# EAGLE schematic EIT sample circuit (EAGLE 7.7.0)
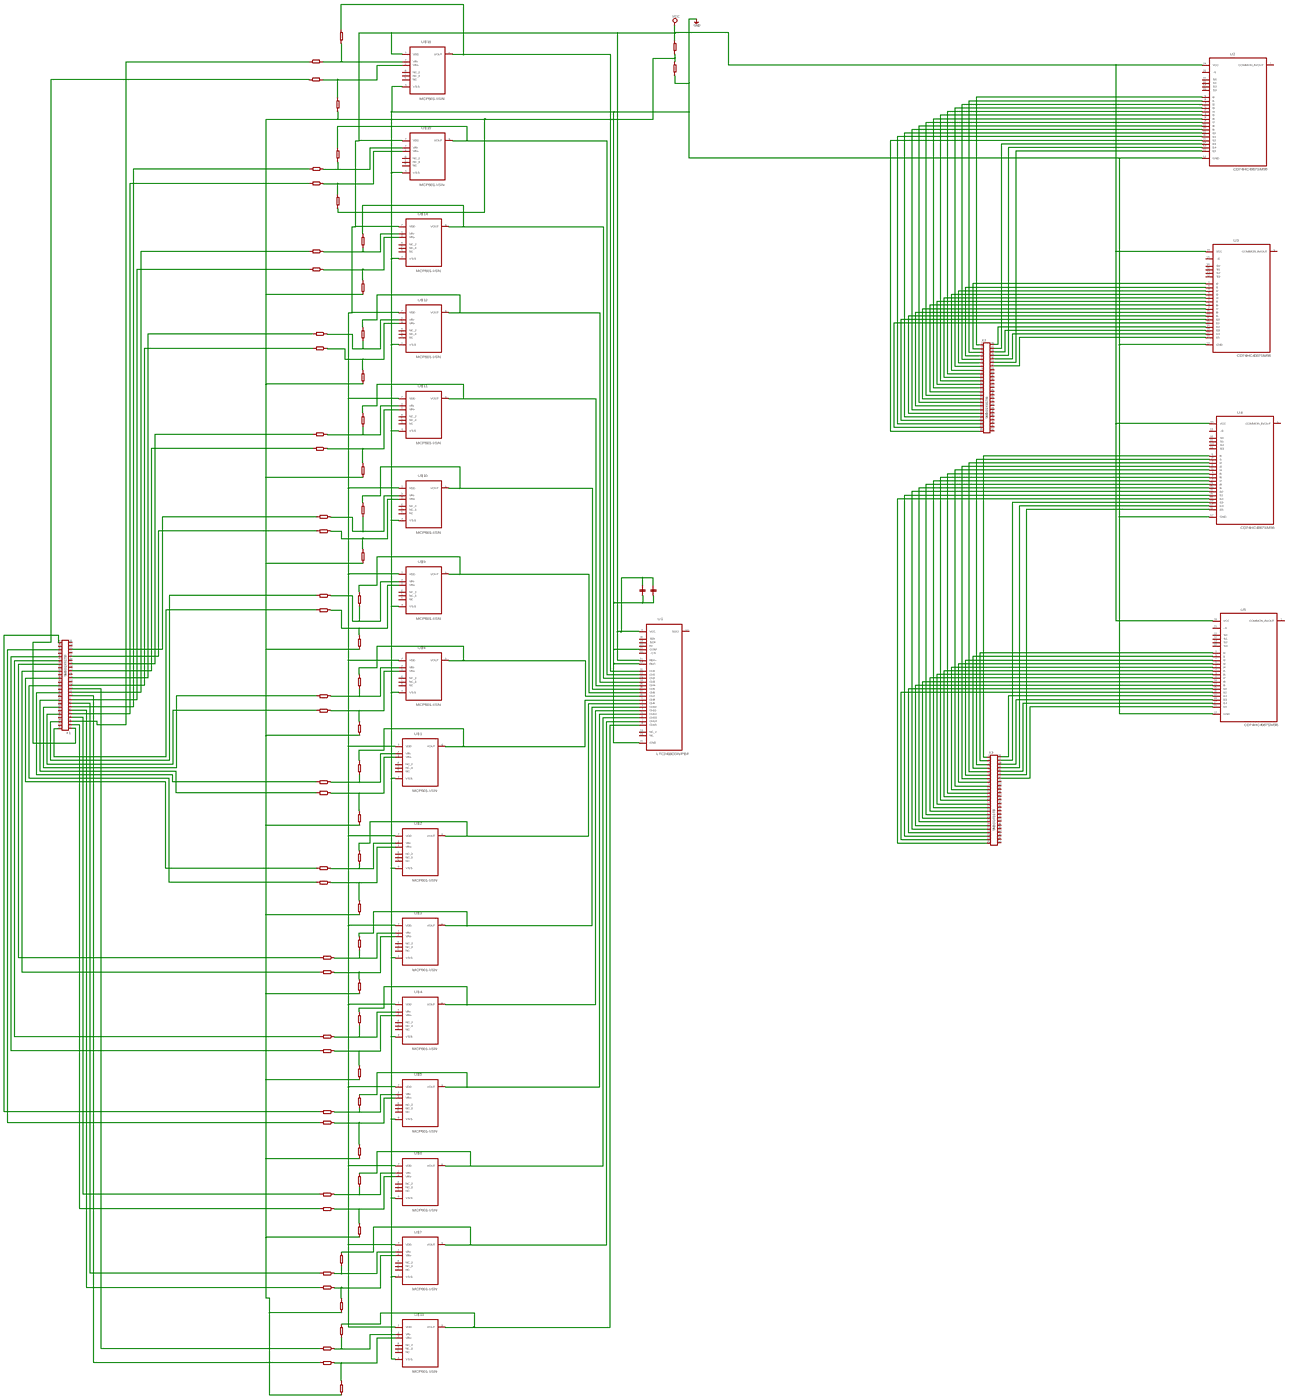
[diagram p0: schematic, sheet 1, overview]
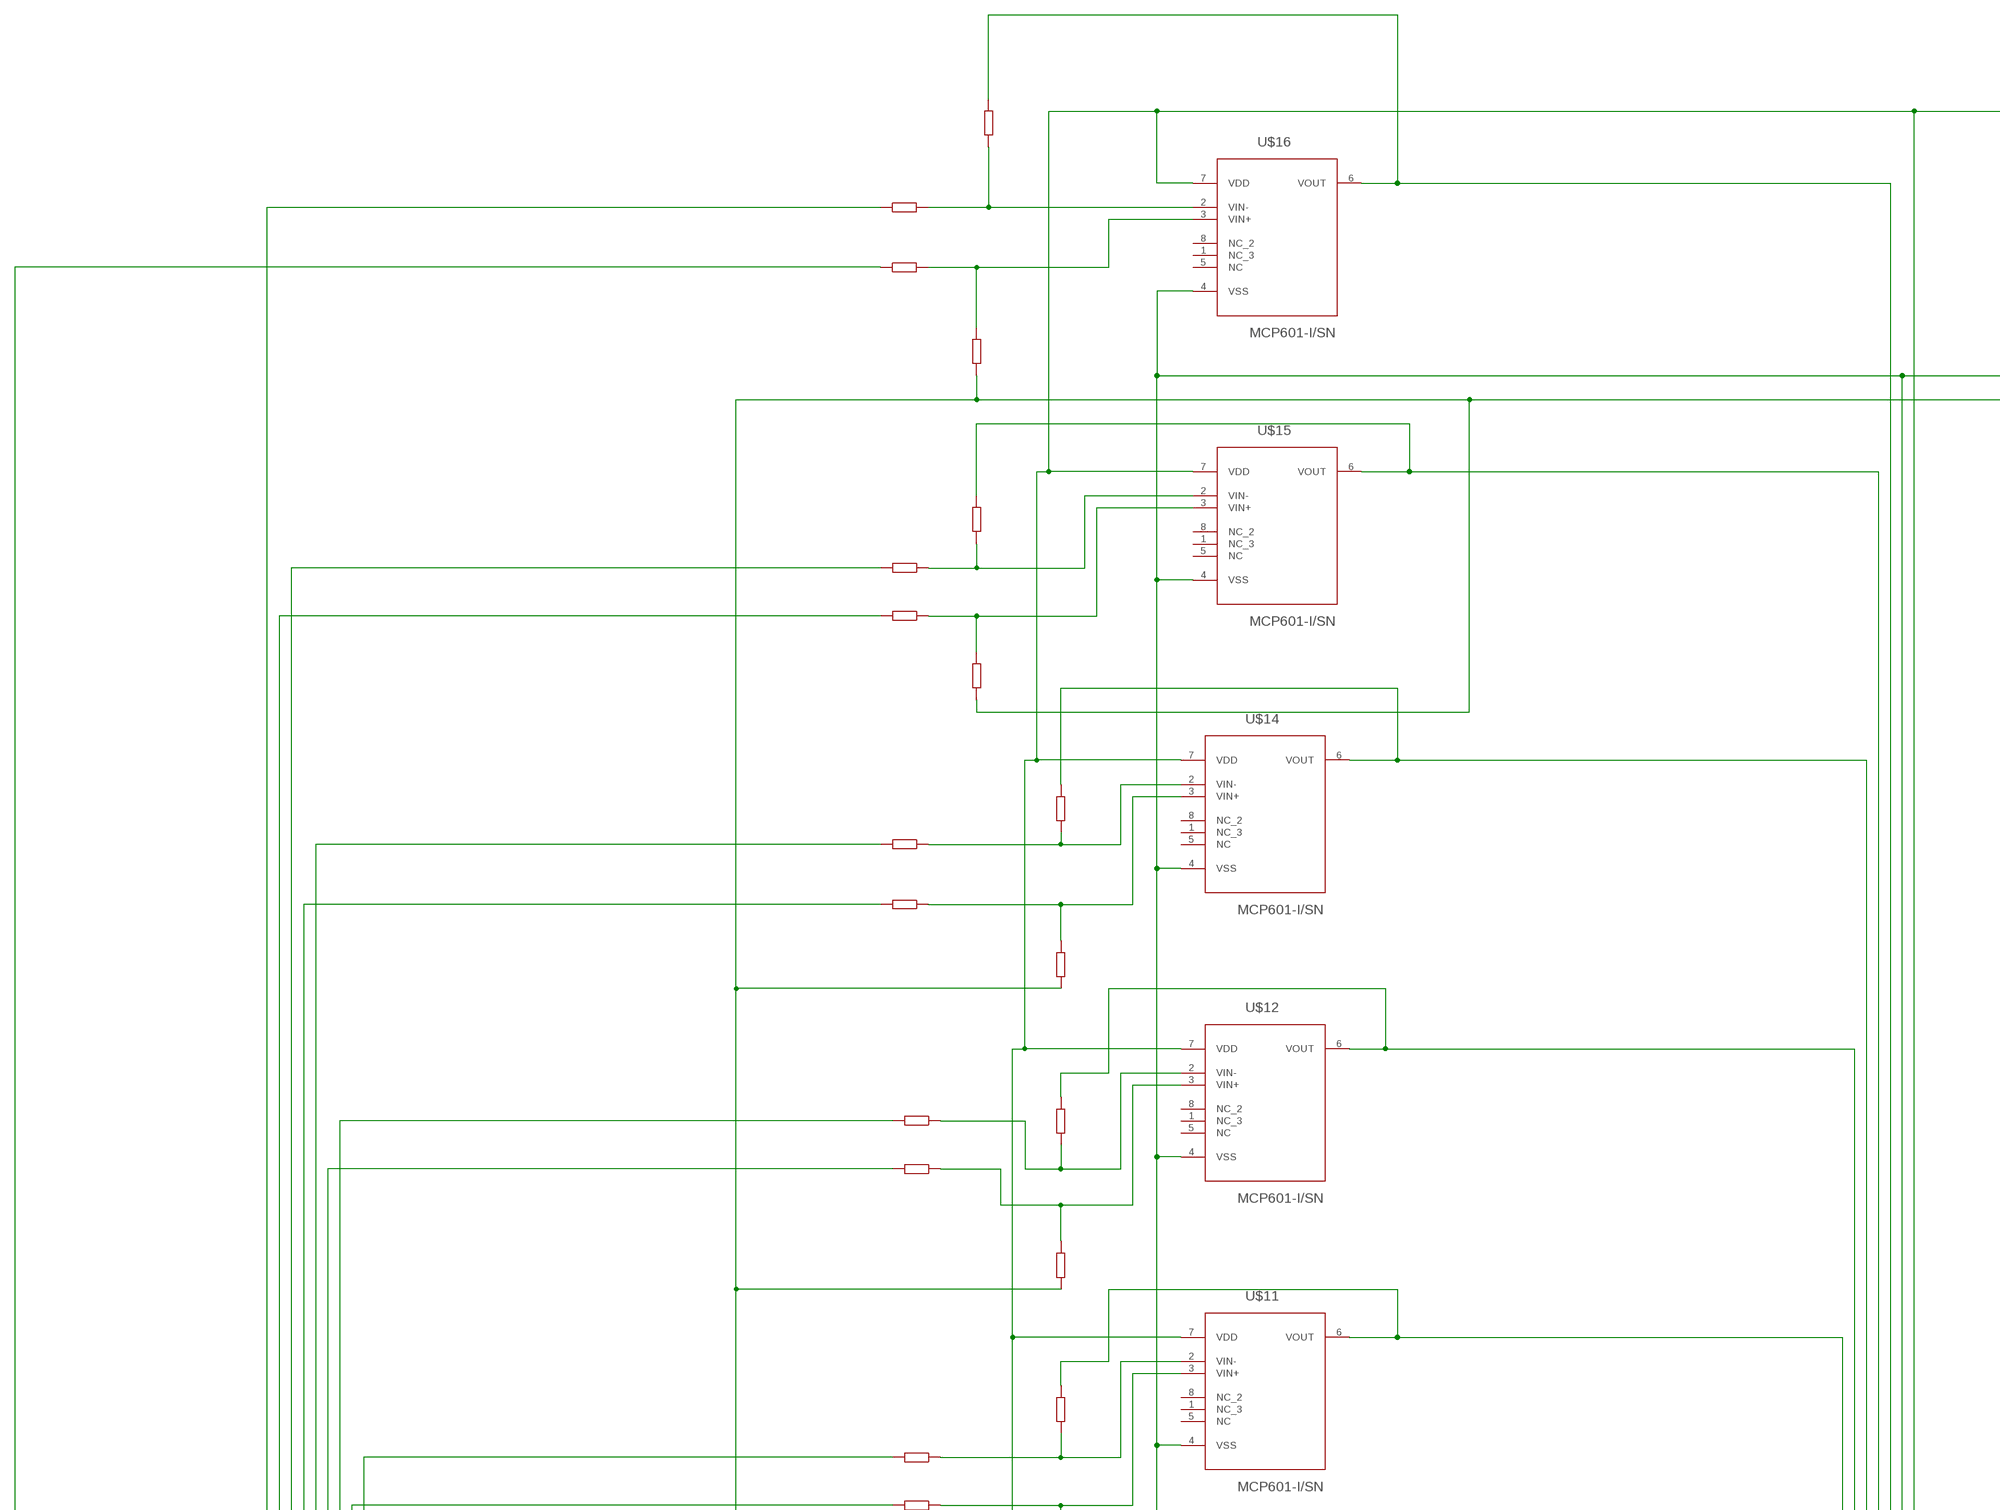
[diagram p1: schematic, sheet 1, part 1 of 5]
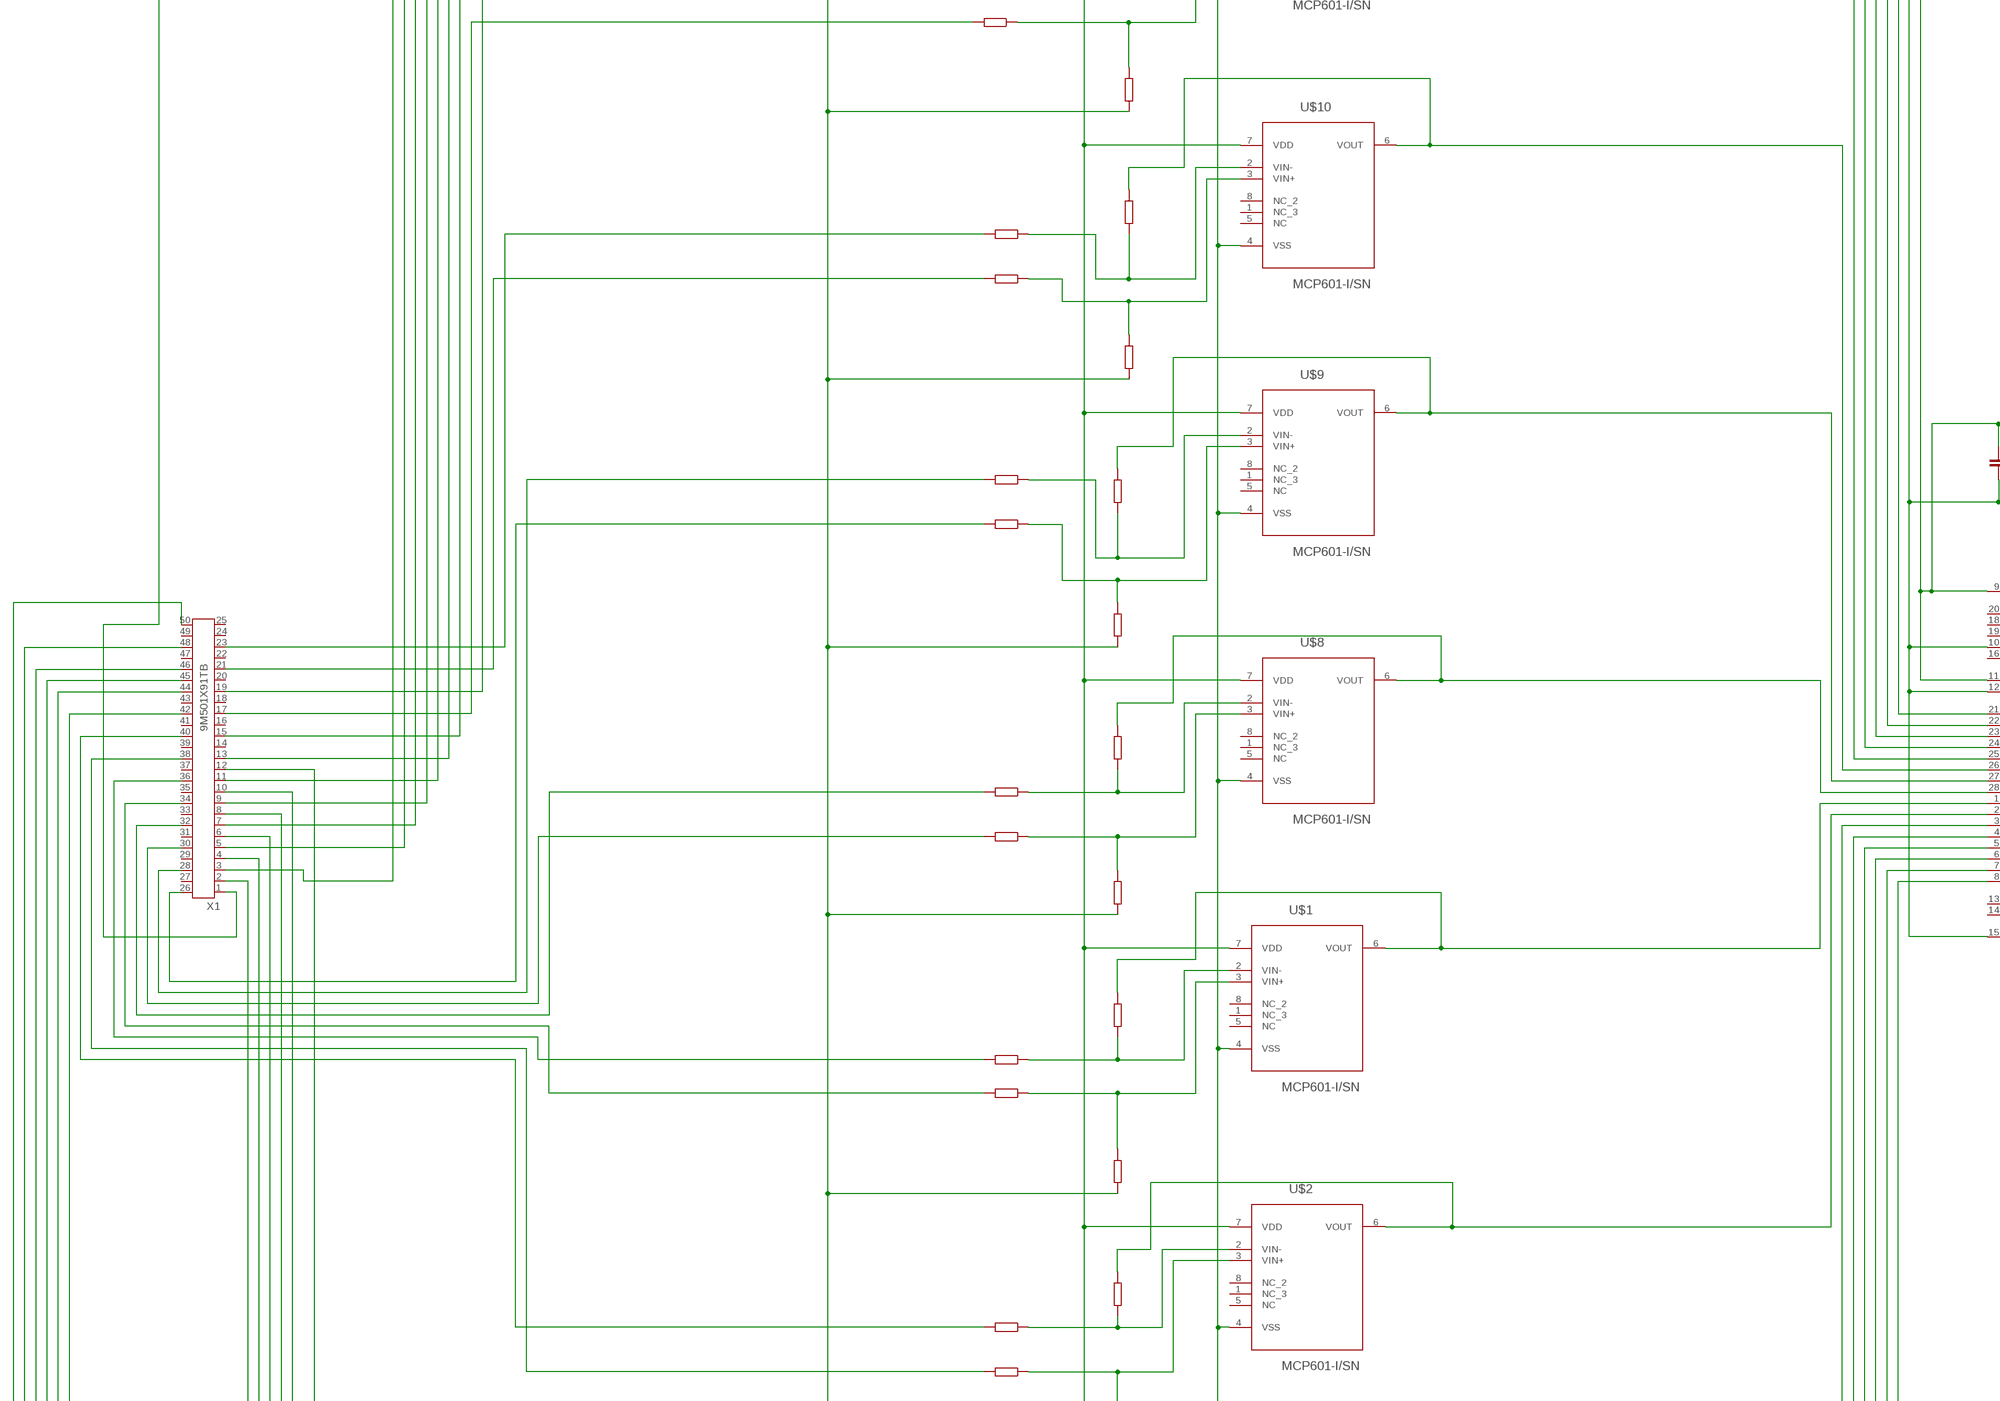
[diagram p2: schematic, sheet 1, part 2 of 5]
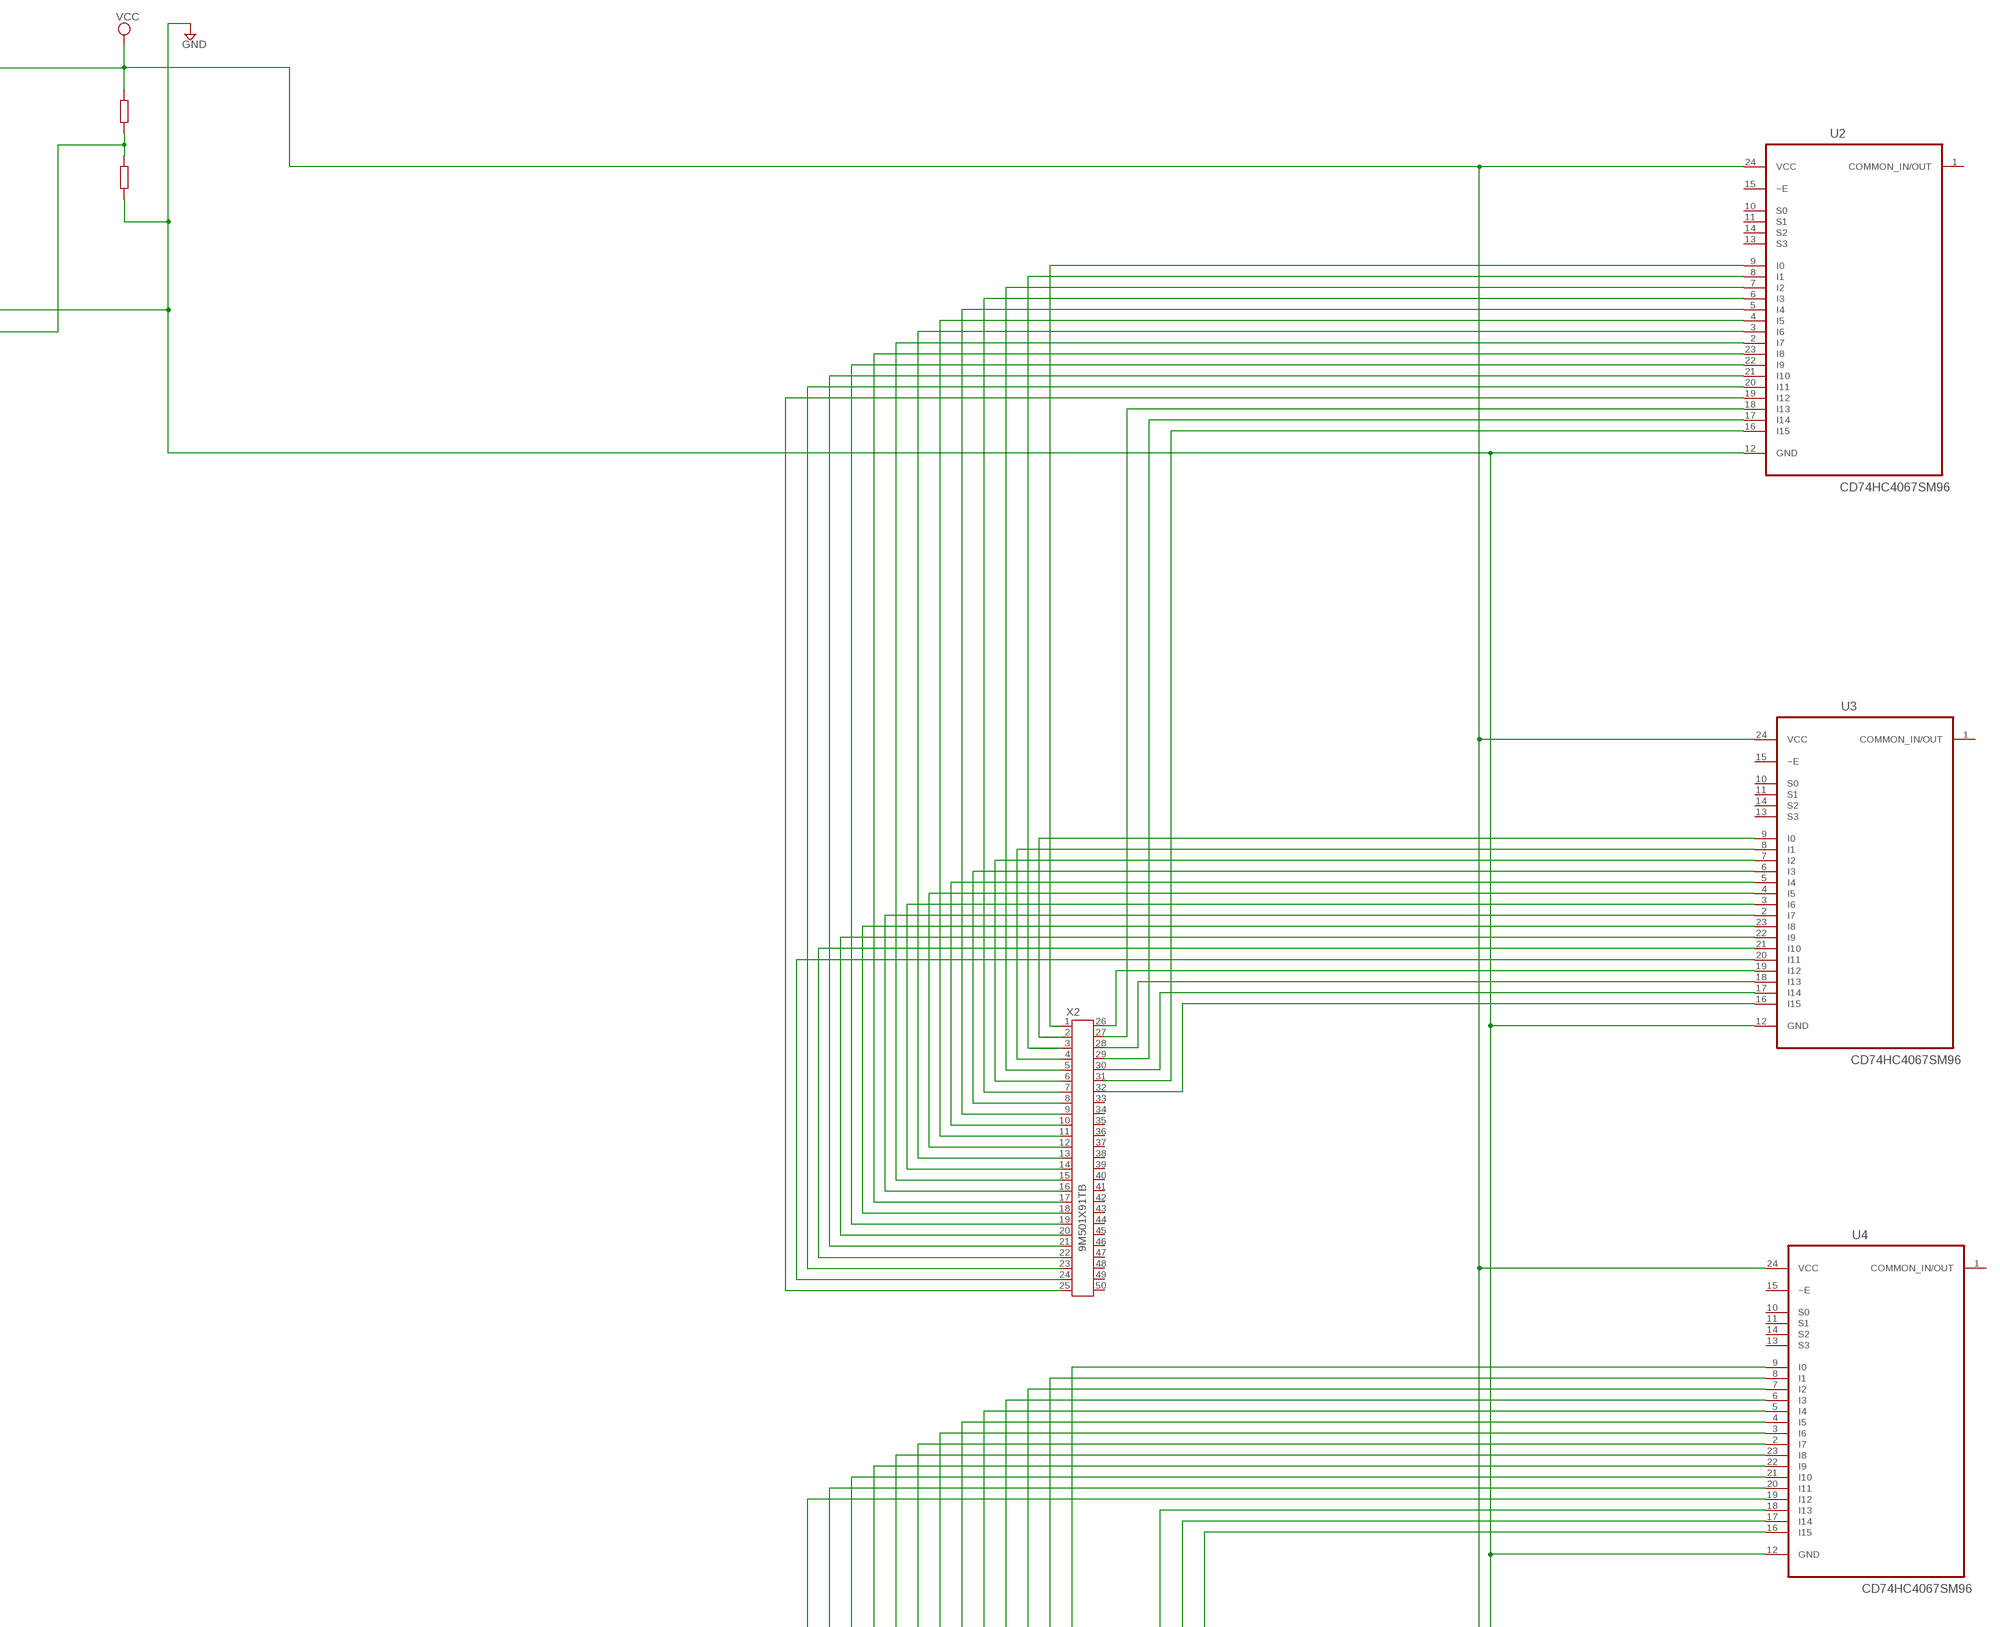
[diagram p3: schematic, sheet 1, part 3 of 5]
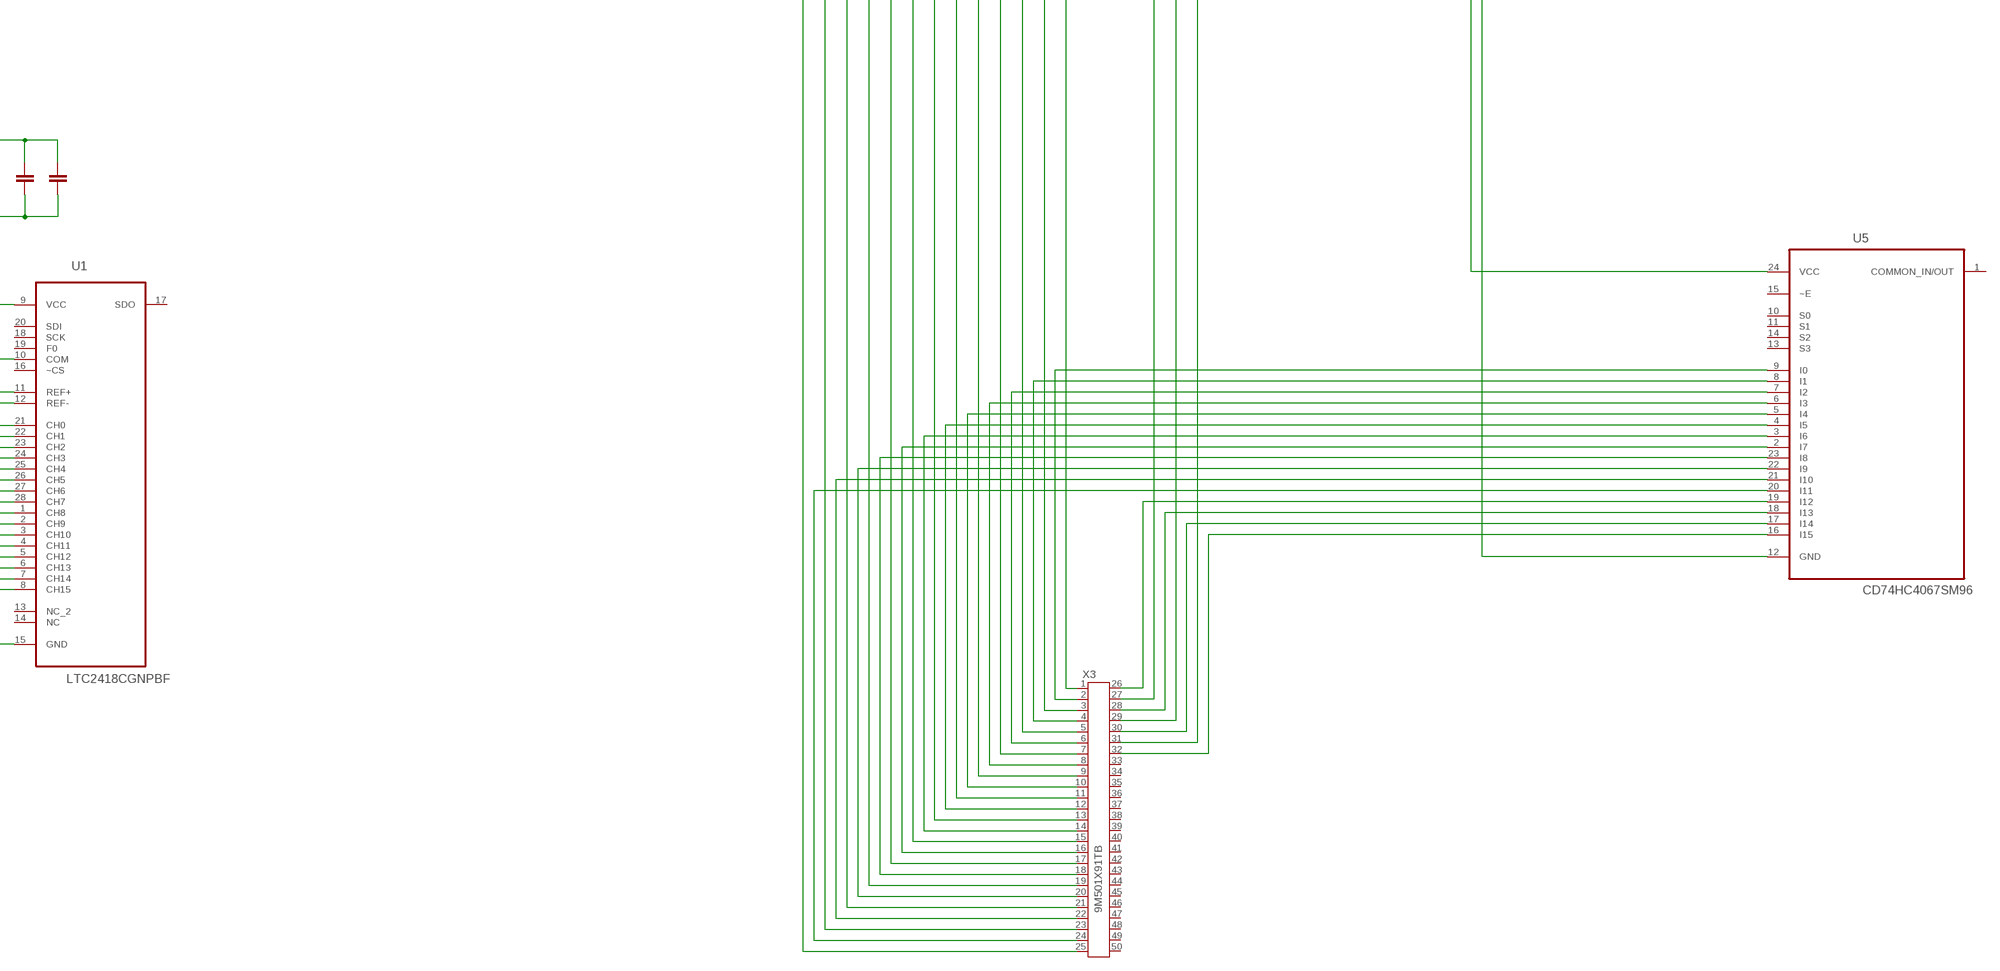
[diagram p4: schematic, sheet 1, part 4 of 5]
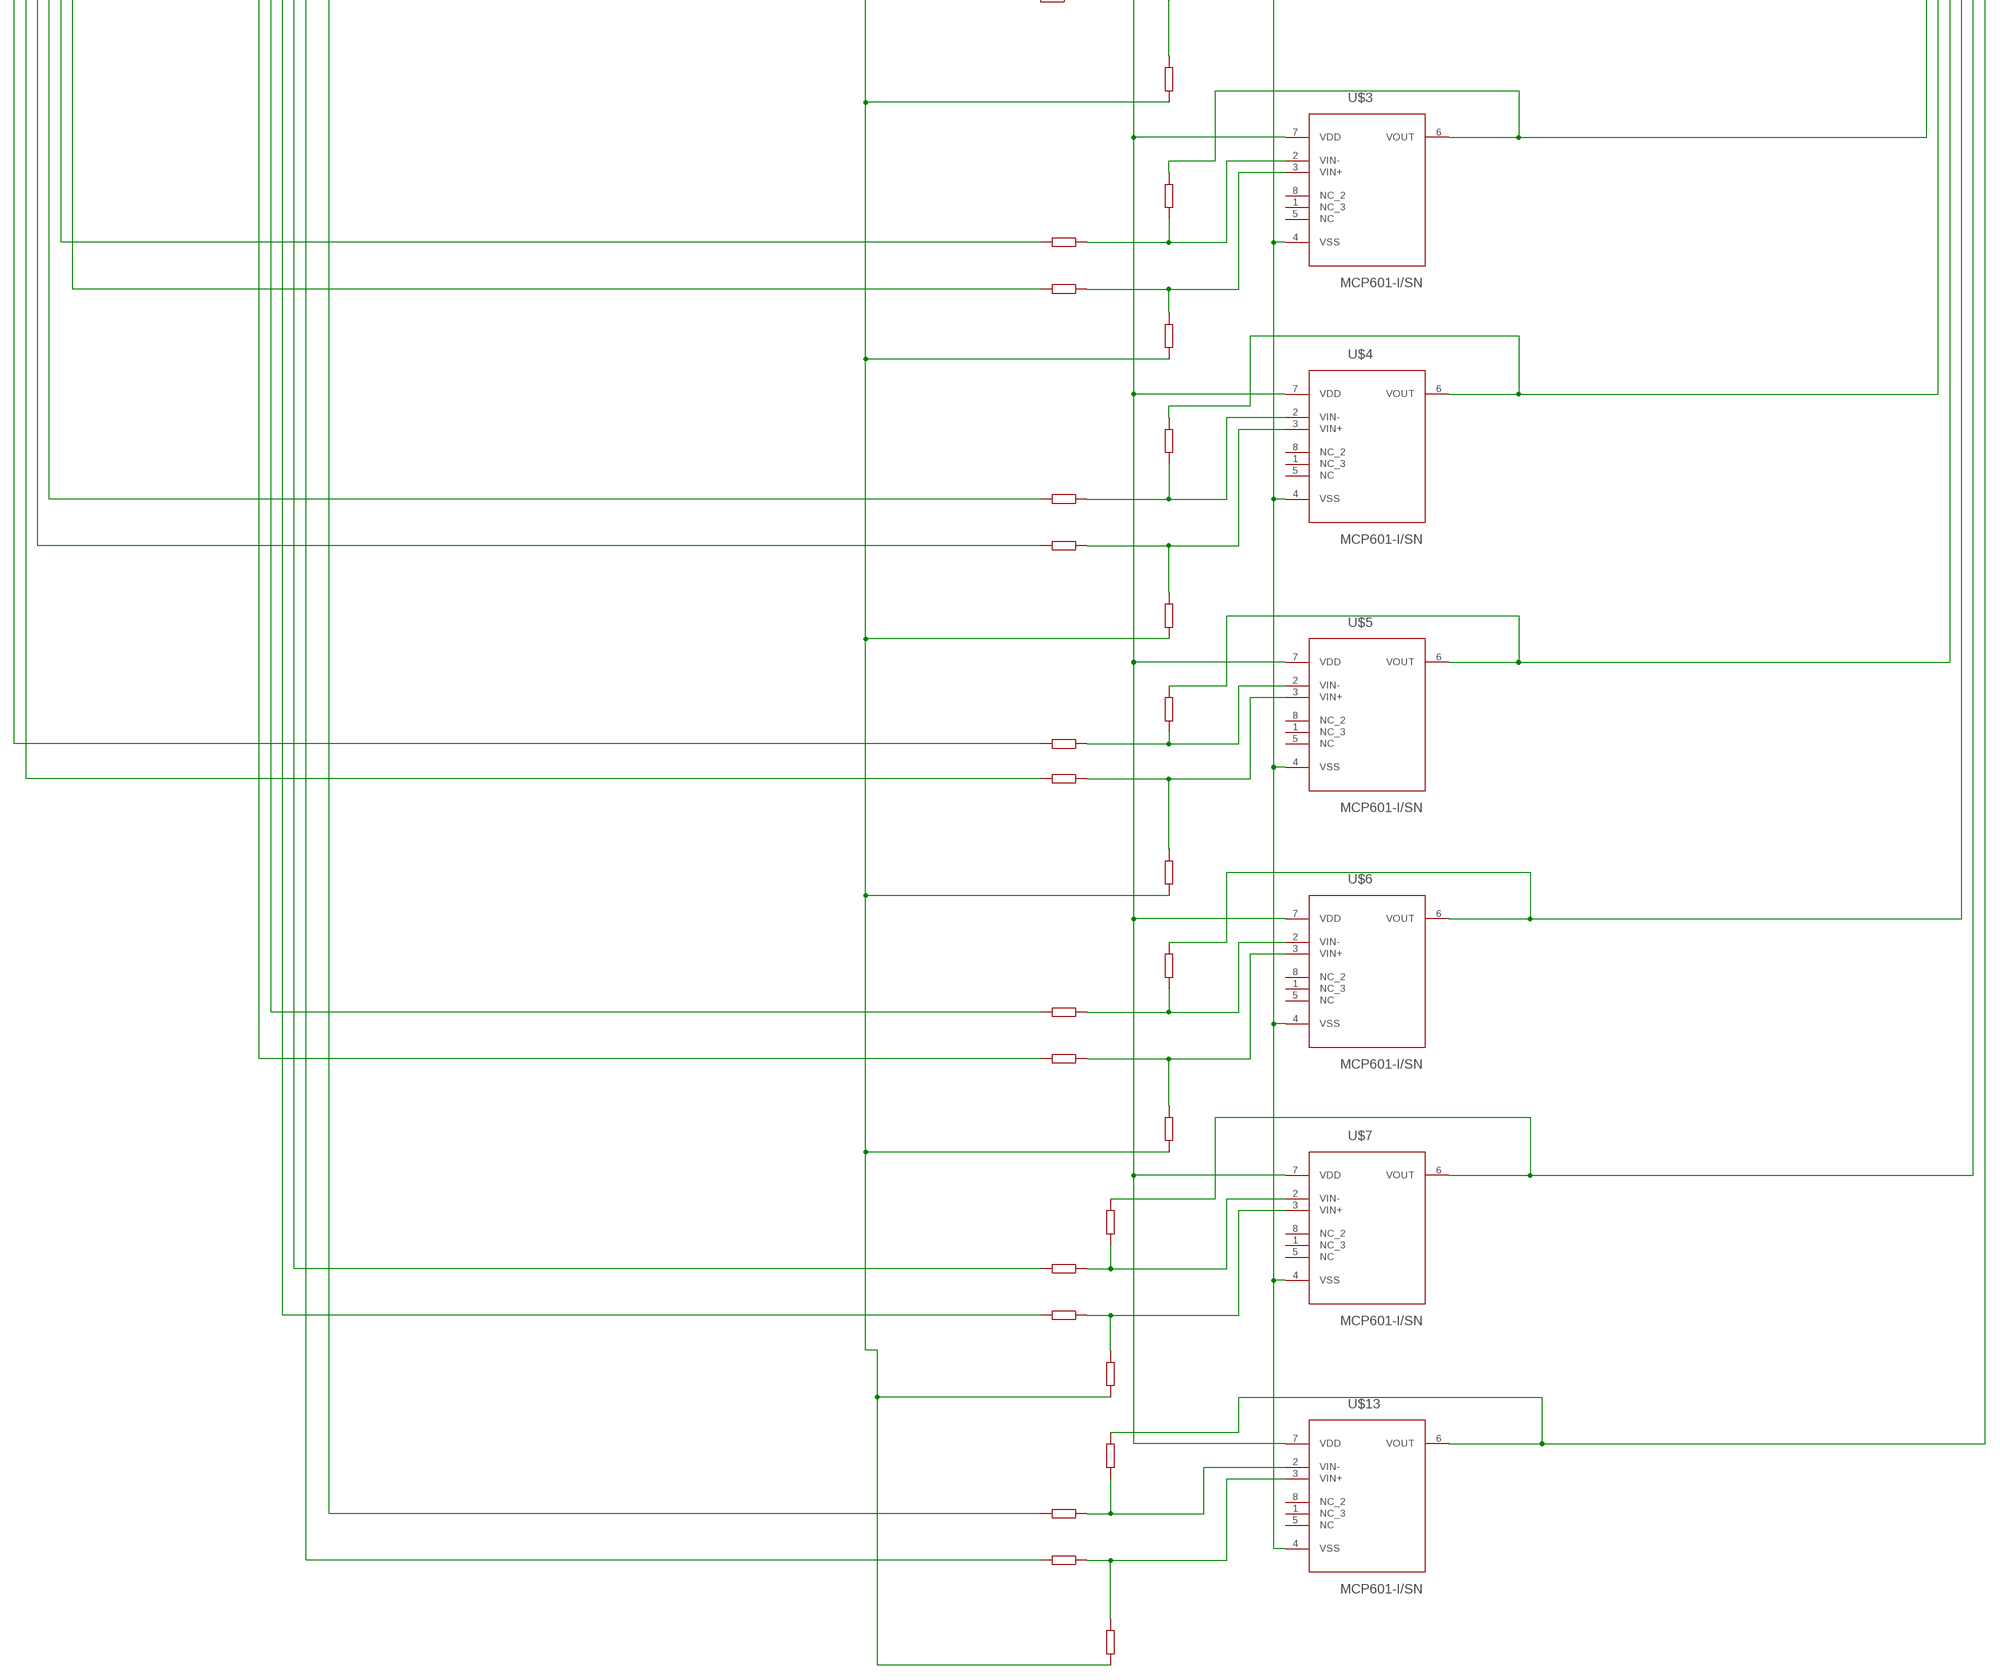
[diagram p5: schematic, sheet 1, part 5 of 5]

## Parts
U1  LTC2418CGNPBF  [SOP63P600X175-28N]
U2  CD74HC4067SM96  [SOP65P780X200-24N]
U3  CD74HC4067SM96  [SOP65P780X200-24N]
U4  CD74HC4067SM96  [SOP65P780X200-24N]
U5  CD74HC4067SM96  [SOP65P780X200-24N]
U$1  MCP601-I/SN  [SOIC127P600X175-8N]
U$2  MCP601-I/SN  [SOIC127P600X175-8N]
U$3  MCP601-I/SN  [SOIC127P600X175-8N]
U$4  MCP601-I/SN  [SOIC127P600X175-8N]
U$5  MCP601-I/SN  [SOIC127P600X175-8N]
U$6  MCP601-I/SN  [SOIC127P600X175-8N]
U$7  MCP601-I/SN  [SOIC127P600X175-8N]
U$8  MCP601-I/SN  [SOIC127P600X175-8N]
U$9  MCP601-I/SN  [SOIC127P600X175-8N]
U$10  MCP601-I/SN  [SOIC127P600X175-8N]
U$11  MCP601-I/SN  [SOIC127P600X175-8N]
U$12  MCP601-I/SN  [SOIC127P600X175-8N]
U$13  MCP601-I/SN  [SOIC127P600X175-8N]
U$14  MCP601-I/SN  [SOIC127P600X175-8N]
U$15  MCP601-I/SN  [SOIC127P600X175-8N]
U$16  MCP601-I/SN  [SOIC127P600X175-8N]
X1  9M501X91TB  [9M501X91]
X2  9M501X91TB  [9M501X91]
X3  9M501X91TB  [9M501X91]

## Nets
GND: U1.10(COM) U1.12(REF-) U1.15(GND) U2.12(GND) U3.12(GND) U4.12(GND) U5.12(GND) U$1.4(VSS) U$2.4(VSS) U$3.4(VSS) U$4.4(VSS) U$5.4(VSS) U$6.4(VSS) U$7.4(VSS) U$8.4(VSS) U$9.4(VSS) U$10.4(VSS) U$11.4(VSS) U$12.4(VSS) U$13.4(VSS) U$14.4(VSS) U$15.4(VSS) U$16.4(VSS)
N$1: U1.21(CH0) U$16.6(VOUT)
N$2: U1.22(CH1) U$15.6(VOUT)
N$3: U1.23(CH2) U$14.6(VOUT)
N$4: U1.24(CH3) U$12.6(VOUT)
N$5: U1.25(CH4) U$11.6(VOUT)
N$6: U1.26(CH5) U$10.6(VOUT)
N$7: U1.27(CH6) U$9.6(VOUT)
N$8: U1.28(CH7) U$8.6(VOUT)
N$9: U1.1(CH8) U$1.6(VOUT)
N$10: U1.2(CH9) U$2.6(VOUT)
N$11: U1.3(CH10) U$3.6(VOUT)
N$12: U1.4(CH11) U$4.6(VOUT)
N$13: U1.5(CH12) U$5.6(VOUT)
N$14: U1.6(CH13) U$6.6(VOUT)
N$15: U1.7(CH14) U$7.6(VOUT)
N$16: U1.8(CH15) U$13.6(VOUT)
N$18: U$6.3(VIN+)
N$19: U$5.3(VIN+)
N$20: U$16.2(VIN-)
N$21: U$4.3(VIN+)
N$22: U$16.3(VIN+)
N$23: U$3.3(VIN+)
N$24: U$15.2(VIN-)
N$25: U$15.3(VIN+)
N$26: U$2.3(VIN+)
N$27: U$14.2(VIN-)
N$28: U$1.3(VIN+)
N$29: U$8.3(VIN+)
N$30: U$12.2(VIN-)
N$31: U$9.3(VIN+)
N$32: U$11.2(VIN-)
N$33: U$10.3(VIN+)
N$34: U$10.2(VIN-)
N$35: U$11.3(VIN+)
N$36: U$9.2(VIN-)
N$37: U$12.3(VIN+)
N$38: U$8.2(VIN-)
N$39: U$14.3(VIN+)
N$40: U$1.2(VIN-)
N$41: X1.1
N$42: U$2.2(VIN-)
N$43: X1.3
N$44: U$3.2(VIN-)
N$45: X1.5
N$46: U$4.2(VIN-)
N$47: X1.7
N$48: U$5.2(VIN-)
N$49: X1.9
N$50: U$6.2(VIN-)
N$51: X1.11
N$52: U$7.2(VIN-)
N$53: X1.13
N$54: U$13.2(VIN-)
N$55: X1.15
N$56: U$13.3(VIN+)
N$57: X1.17
N$58: U$7.3(VIN+)
N$59: X1.19
N$60: X1.21
N$61: X1.23
N$62: X1.26
N$63: X1.28
N$64: X1.30
N$65: X1.32
N$66: X1.34
N$67: X1.36
N$68: X1.38
N$69: X1.40
N$70: X1.42
N$71: X1.44
N$72: X1.46
N$73: X1.48
N$74: X1.50
N$75: X1.45
N$76: X1.2
N$77: X1.4
N$78: X1.6
N$79: X1.8
N$80: X1.10
N$81: X1.12
N$82: U2.9(I0) X2.1
N$83: U3.9(I0) X2.2
N$84: U2.8(I1) X2.3
N$85: U3.8(I1) X2.4
N$86: U2.7(I2) X2.5
N$87: U3.7(I2) X2.6
N$88: U2.6(I3) X2.7
N$89: U3.6(I3) X2.8
N$90: U2.5(I4) X2.9
N$91: U3.5(I4) X2.10
N$92: U2.4(I5) X2.11
N$93: U3.4(I5) X2.12
N$94: U2.3(I6) X2.13
N$95: U3.3(I6) X2.14
N$96: U2.2(I7) X2.15
N$97: U3.2(I7) X2.16
N$98: U2.23(I8) X2.17
N$99: U3.23(I8) X2.18
N$100: U2.22(I9) X2.19
N$101: U3.22(I9) X2.20
N$102: U2.21(I10) X2.21
N$103: U3.21(I10) X2.22
N$104: U2.20(I11) X2.23
N$105: U3.20(I11) X2.24
N$106: U2.19(I12) X2.25
N$107: U3.19(I12) X2.26
N$108: U2.18(I13) X2.27
N$109: U3.18(I13) X2.28
N$110: U3.17(I14) X2.30
N$111: U3.16(I15) X2.32
N$112: U2.17(I14) X2.29
N$113: U2.16(I15) X2.31
N$114: U4.9(I0) X3.1
N$115: U5.9(I0) X3.2
N$116: U4.8(I1) X3.3
N$117: U5.8(I1) X3.4
N$118: U4.7(I2) X3.5
N$119: U5.7(I2) X3.6
N$120: U4.6(I3) X3.7
N$121: U5.6(I3) X3.8
N$122: U4.5(I4) X3.9
N$123: U5.5(I4) X3.10
N$124: U4.4(I5) X3.11
N$125: U5.4(I5) X3.12
N$126: U4.3(I6) X3.13
N$127: U5.3(I6) X3.14
N$128: U4.2(I7) X3.15
N$129: U5.2(I7) X3.16
N$130: U4.23(I8) X3.17
N$131: U5.23(I8) X3.18
N$132: U4.22(I9) X3.19
N$133: U5.22(I9) X3.20
N$134: U4.21(I10) X3.21
N$135: U5.21(I10) X3.22
N$136: U4.20(I11) X3.23
N$137: U5.20(I11) X3.24
N$138: U5.19(I12) X3.26
N$139: U4.19(I12) X3.25
N$140: U4.18(I13) X3.27
N$141: U5.18(I13) X3.28
N$142: U4.17(I14) X3.29
N$143: U5.17(I14) X3.30
N$144: U5.16(I15) X3.32
N$145: U4.16(I15) X3.31
VCC: U1.9(VCC) U1.11(REF+) U2.24(VCC) U3.24(VCC) U4.24(VCC) U5.24(VCC) U$1.7(VDD) U$2.7(VDD) U$3.7(VDD) U$4.7(VDD) U$5.7(VDD) U$6.7(VDD) U$7.7(VDD) U$8.7(VDD) U$9.7(VDD) U$10.7(VDD) U$11.7(VDD) U$12.7(VDD) U$13.7(VDD) U$14.7(VDD) U$15.7(VDD) U$16.7(VDD)
Unconnected: U1.13(NC_2) U1.14(NC) U1.16(~CS) U1.17(SDO) U1.18(SCK) U1.19(F0) U1.20(SDI) U2.1(COMMON_IN/OUT) U2.10(S0) U2.11(S1) U2.13(S3) U2.14(S2) U2.15(~E) U3.1(COMMON_IN/OUT) U3.10(S0) U3.11(S1) U3.13(S3) U3.14(S2) U3.15(~E) U4.1(COMMON_IN/OUT) U4.10(S0) U4.11(S1) U4.13(S3) U4.14(S2) U4.15(~E) U5.1(COMMON_IN/OUT) U5.10(S0) U5.11(S1) U5.13(S3) U5.14(S2) U5.15(~E) U$1.1(NC_3) U$1.5(NC) U$1.8(NC_2) U$2.1(NC_3) U$2.5(NC) U$2.8(NC_2) U$3.1(NC_3) U$3.5(NC) U$3.8(NC_2) U$4.1(NC_3) U$4.5(NC) U$4.8(NC_2) U$5.1(NC_3) U$5.5(NC) U$5.8(NC_2) U$6.1(NC_3) U$6.5(NC) U$6.8(NC_2) U$7.1(NC_3) U$7.5(NC) U$7.8(NC_2) U$8.1(NC_3) U$8.5(NC) U$8.8(NC_2) U$9.1(NC_3) U$9.5(NC) U$9.8(NC_2) U$10.1(NC_3) U$10.5(NC) U$10.8(NC_2) U$11.1(NC_3) U$11.5(NC) U$11.8(NC_2) U$12.1(NC_3) U$12.5(NC) U$12.8(NC_2) U$13.1(NC_3) U$13.5(NC) U$13.8(NC_2) U$14.1(NC_3) U$14.5(NC) U$14.8(NC_2) U$15.1(NC_3) U$15.5(NC) U$15.8(NC_2) U$16.1(NC_3) U$16.5(NC) U$16.8(NC_2) X1.14 X1.16 X1.18 X1.20 X1.22 X1.24 X1.25 X1.27 X1.29 X1.31 X1.33 X1.35 X1.37 X1.39 X1.41 X1.43 X1.47 X1.49 X2.33 X2.34 X2.35 X2.36 X2.37 X2.38 X2.39 X2.40 X2.41 X2.42 X2.43 X2.44 X2.45 X2.46 X2.47 X2.48 X2.49 X2.50 X3.33 X3.34 X3.35 X3.36 X3.37 X3.38 X3.39 X3.40 X3.41 X3.42 X3.43 X3.44 X3.45 X3.46 X3.47 X3.48 X3.49 X3.50

## Library data of the parts
U1 = LTC_By_element14_Batch_1:LTC2418CGNPBF: ADC; MPN: LTC2418CGN#PBF; OC_FARNELL: 1503408; OC_NEWARK: 56M5504; PACKAGE: SSOP-28; SUPPLIER: Linear Technology
U2-U5 = Texas Instruments_By_element14_Batch_1:CD74HC4067SM96: 16-Channel Analog Multiplexer/Demultiplexer; MPN: CD74HC4067SM96; OC_FARNELL: 1601157; OC_NEWARK: 13N4201; PACKAGE: SOP-24; SUPPLIER: TEXAS INSTRUMENTS
U$1-U$16 = Microchip_By_element14_Batch_1:MCP601-I/SN: CMOS Op Amp; DESCRIPTION: CMOS Op Amps; MPN: MCP601-I/SN; OC_FARNELL: 9758623; OC_NEWARK: 61K2952; PACKAGE: SOIC-8; SUPPLIER: Microchip
X1-X3 = con-3m:9M501X91TB: CONNECTOR PCMCIA-CompactFlash; OC_FARNELL: unknown; OC_NEWARK: unknown